# Altium schematic sheet Oscillator_12MHz.SchDoc: Oscillator 12MHz
size A4; Class: Clock; PageSetup: Record=PageOptions|CenterHorizontal=True|CenterVertical=True|PrintScale=1.00|XCorrection=1.00|YCorrection=1.00|PrintKind=0|BorderSize=5000000|LeftOffset=0|BottomOffset=0|Orientation=2|PaperLength=1000|PaperWidth=1000|Scale=100|PaperSource=7|PrintQuality=-4|MediaType=1|DitherType=10|PaperKind=A1 (594 x 841mm)|PrintScaleMode=1
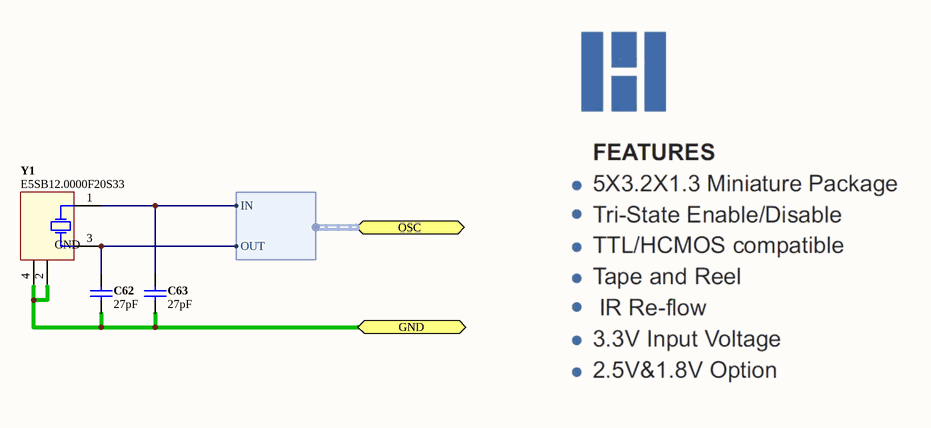
[diagram p0: Oscillator_12MHz.SchDoc]

## Parts
C62  value 27pF  [CAPC0402(1005)60_N]  (hidden comment: CAP 27pF 50V 0402(1005))
C63  value 27pF  [CAPC0402(1005)60_N]  (hidden comment: CAP 27pF 50V 0402(1005))
Y1  E5SB12.0000F20S33  [HOSC-L500HW320H105-4]

## Ports
GND, OSC (harness OSC)

## Harnesses
OSC: IN, OUT

## Nets
GND: C62.2 C63.2 Y1.2(GND) Y1.4(GND) ; port GND
NetC62_1: C62.1 Y1.3(X2) ; port OSC.OUT
NetC63_1: C63.1 Y1.1(X1) ; port OSC.IN

## Notes on the sheet
- Sheet Title
- Project Title
- Size:
- Date:
- A4
- Item:
- Time:
- Revision:
- Sheet
- of
- File:

## Library data of the parts
C62 C63 = CMP-1034-00963-1: CAP 27pF 50V ±5% 0402 (1005 Metric) Thickness 0.6mm SMD; Case-EIA: 0402; Case-Metric: 1005; Max Thickness: 0.6 mm; Rated Voltage: 50 V; Technology: SMT; Tolerance: ±5%
Y1 = CMP-5195-00000-1: Crystal, SMD, 12MHz, 10.0pF; Packing Type: Tape & Reel; Body Shape: Rectangular; Mounting Features: Surface Mount; Sub-class: Crystal Oscillator; Class: Oscillator; IEC-class: Oscillators; Storage Temperature: -55 to 125 degC; Case Size: 5.0 x 3.2 mm; Datasheet: http://www.hosonic.com.hk/manage/productsimg/photo1/HXO-56%20&%2057%20&%2059%20Surface%20Mount%20Oscillator%205.0x3.2x1.3mm%203.3V%20&%201.8V%20&%202.5V.pdf; Operating Temperature: -20 to 75 degC; Price: 1.4742